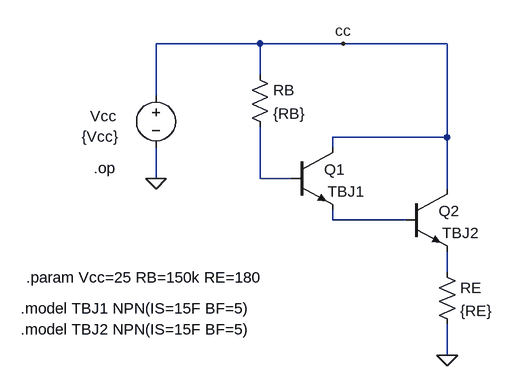
[diagram p0: schematic COMB05op.asc]
COMB05op.asc, the LTspice schematic file:
Version 4
SHEET 1 1608 1076
WIRE 896 -144 736 -144
WIRE 1024 -144 896 -144
WIRE 1184 -144 1024 -144
WIRE 896 -96 896 -144
WIRE 736 -64 736 -144
WIRE 1184 0 1184 -144
WIRE 1184 0 1008 0
WIRE 1008 16 1008 0
WIRE 736 64 736 16
WIRE 896 64 896 -16
WIRE 944 64 896 64
WIRE 1184 80 1184 0
WIRE 1008 128 1008 112
WIRE 1120 128 1008 128
WIRE 1184 208 1184 176
WIRE 1184 336 1184 288
FLAG 1184 336 0
FLAG 736 64 0
FLAG 1024 -144 cc
SYMBOL res 1168 192 R0
SYMATTR InstName RE
SYMATTR Value {RE}
SYMBOL voltage 736 -80 R0
WINDOW 123 0 0 Left 0
WINDOW 39 0 0 Left 0
WINDOW 0 -101 48 Left 2
WINDOW 3 -114 79 Left 2
SYMATTR InstName Vcc
SYMATTR Value {Vcc}
SYMBOL npn 1120 80 R0
WINDOW 0 51 34 Left 2
SYMATTR InstName Q2
SYMATTR Value TBJ2
SYMBOL res 880 -112 R0
SYMATTR InstName RB
SYMATTR Value {RB}
SYMBOL npn 944 16 R0
WINDOW 0 51 34 Left 2
SYMATTR InstName Q1
SYMATTR Value TBJ1
TEXT 640 48 Left 2 !.op
TEXT 536 216 Left 2 !.param Vcc=25 RB=150k RE=180
TEXT 528 264 Left 2 !.model TBJ1 NPN(IS=15F BF=5)
TEXT 528 296 Left 2 !.model TBJ2 NPN(IS=15F BF=5)

The netlist it stands for:
* COMB05op.asc
RE N003 0 {RE}
Vcc cc 0 {Vcc}
Q2 cc N002 N003 0 TBJ2
RB cc N001 {RB}
Q1 cc N001 N002 0 TBJ1
.model NPN NPN
.model PNP PNP
.lib standard.bjt
.op
.param Vcc=25 RB=150k RE=180
.model TBJ1 NPN(IS=15F BF=5)
.model TBJ2 NPN(IS=15F BF=5)
.backanno
.end